# EAGLE design v1 (EAGLE 9.6.2)
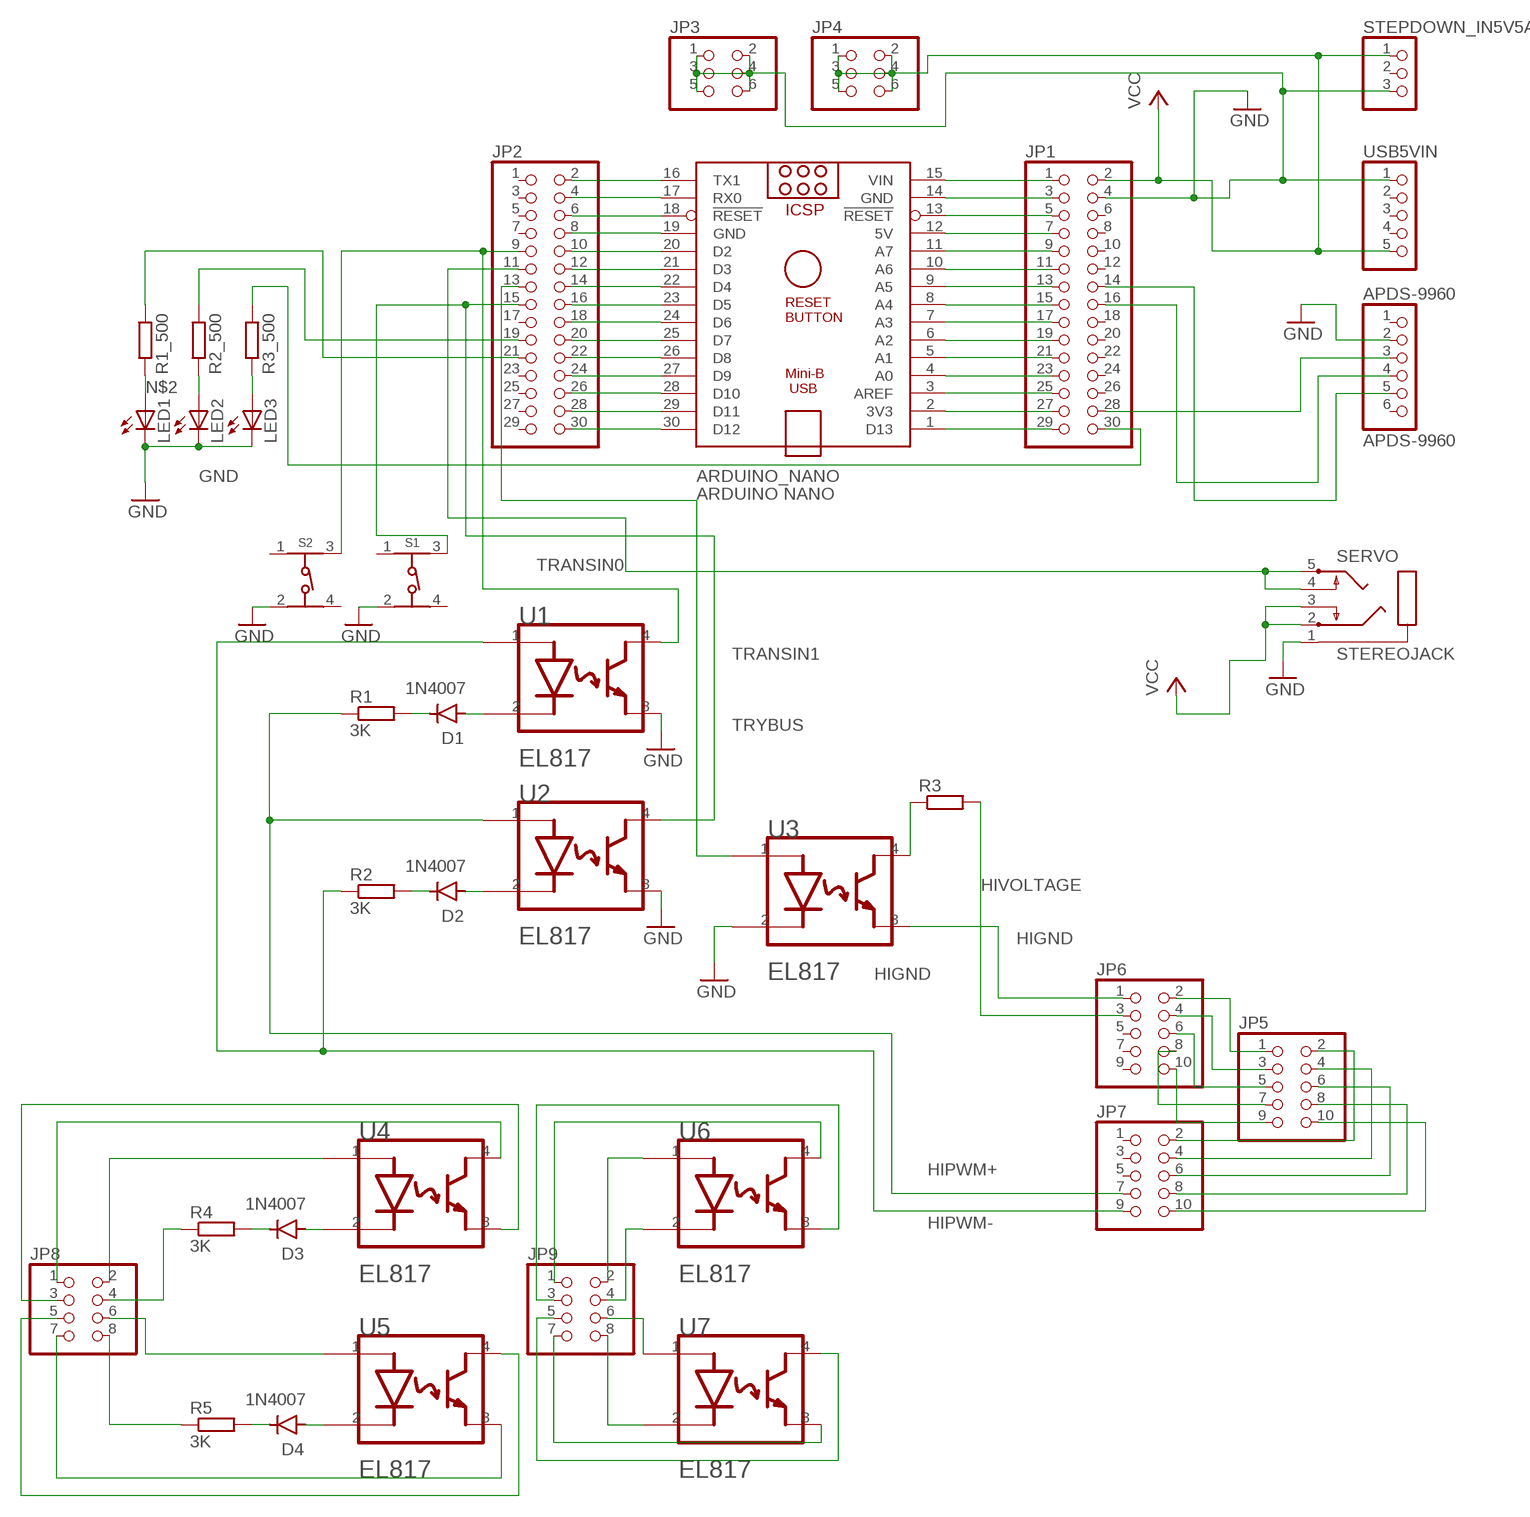
[diagram p0: schematic, sheet 1]

## Parts
APDS-9960  APDS-9960  PINHD-1X6  [1X06]
ARDUINO_NANO  ARDUINO NANO  ARDUINO_NANO  [ARDUINO_NANO]
D1  1N4007  [DO-41]
D2  1N4007  [DO-41]
D3  1N4007  [DO-41]
D4  1N4007  [DO-41]
JP1  PINHD-2X15  [2X15]
JP2  PINHD-2X15  [2X15]
JP3  PINHD-2X3  [2X03]
JP4  PINHD-2X3  [2X03]
JP5  PINHD-2X5  [2X05]
JP6  PINHD-2X5  [2X05]
JP7  PINHD-2X5  [2X05]
JP8  PINHD-2X4  [2X04]
JP9  PINHD-2X4  [2X04]
LED1  LED3MM  [LED3MM]
LED2  LED3MM  [LED3MM]
LED3  LED3MM  [LED3MM]
R1  3K  R-EU_0207/10  [0207/10]
R1_500  R-EU_0207/10  [0207/10]
R2  3K  R-EU_0207/10  [0207/10]
R2_500  R-EU_0207/10  [0207/10]
R3  R-EU_0207/10  [0207/10]
R3_500  R-EU_0207/10  [0207/10]
R4  3K  R-EU_0207/10  [0207/10]
R5  3K  R-EU_0207/10  [0207/10]
S1  430156070726  [4301X60707X6]
S2  430156070726  [4301X60707X6]
SERVO  STEREOJACK  [STX3100]
STEPDOWN_IN5V5A  PINHD-1X3  [1X03]
U1  EVERLIGHT_EL817EVERLIGHT_EL817_0_0  [EVERLIGHT_EL817_0]
U2  EVERLIGHT_EL817EVERLIGHT_EL817_0_0  [EVERLIGHT_EL817_0]
U3  EVERLIGHT_EL817EVERLIGHT_EL817_0_0  [EVERLIGHT_EL817_0]
U4  EVERLIGHT_EL817EVERLIGHT_EL817_0_0  [EVERLIGHT_EL817_0]
U5  EVERLIGHT_EL817EVERLIGHT_EL817_0_0  [EVERLIGHT_EL817_0]
U6  EVERLIGHT_EL817EVERLIGHT_EL817_0_0  [EVERLIGHT_EL817_0]
U7  EVERLIGHT_EL817EVERLIGHT_EL817_0_0  [EVERLIGHT_EL817_0]
USB5VIN  PINHD-1X5  [1X05]

## Nets
3V3: APDS-9960.3 JP1.28
D13: JP1.30 R3_500.1
GND [GND]: APDS-9960.2 JP1.4 JP3.1 JP3.2 JP3.3 JP3.4 JP3.5 JP3.6 LED1.K(C) LED2.K(C) LED3.K(C) S1.2 S2.2 SERVO.1 STEPDOWN_IN5V5A.3 U1.3(EMITTER) U2.3(EMITTER) U3.2(CATHODE) USB5VIN.1
HIGND [GND]: JP6.1 U3.3(EMITTER)
HIPWM+ [+5V]: JP7.7 R1.1 U2.1(ANODE)
HIPWM- [+5V]: JP7.9 R2.1 U1.1(ANODE)
HIPWM-1 [+5V]: JP8.4 R4.1
HIPWM-2 [+5V]: JP8.8 R5.1
HIVOLTAGE [+5V]: JP6.3 R3.2
LEDCLOSE: JP2.19 R2_500.1
LEDSENSOR: JP2.21 R1_500.1
N$1 [+5V]: LED1.A R1_500.2
N$2 [+5V]: LED2.A R2_500.2
N$3: LED3.A R3_500.2
N$4: D3.A U4.2(CATHODE)
N$5: D1.A U1.2(CATHODE)
N$6: D2.A U2.2(CATHODE)
N$7: D1.C R1.2
N$8: D2.C R2.2
N$9: D3.C R4.2
N$10: D4.A U5.2(CATHODE)
N$11: D4.C R5.2
N$12: ARDUINO_NANO.8(A4) JP1.15
N$15 [+5V]: JP5.1 JP6.2
N$16: ARDUINO_NANO.13(!RESET) JP1.5
N$17: ARDUINO_NANO.12(5V) JP1.7
N$18: ARDUINO_NANO.11(A7) JP1.9
N$20: ARDUINO_NANO.10(A6) JP1.11
N$21: ARDUINO_NANO.2(3V3) JP1.27
N$22: ARDUINO_NANO.9(A5) JP1.13
N$23: ARDUINO_NANO.7(A3) JP1.17
N$24: ARDUINO_NANO.6(A2) JP1.19
N$25: ARDUINO_NANO.5(A1) JP1.21
N$26: ARDUINO_NANO.4(A0) JP1.23
N$27: ARDUINO_NANO.3(AREF) JP1.25
N$28: ARDUINO_NANO.15(VIN) JP1.1
N$29: ARDUINO_NANO.1(D13) JP1.29
N$30: ARDUINO_NANO.16(TX1) JP2.2
N$31: ARDUINO_NANO.17(RX0) JP2.4
N$32: ARDUINO_NANO.18(!RESET) JP2.6
N$33: ARDUINO_NANO.19(GND) JP2.8
N$34: ARDUINO_NANO.20(D2) JP2.10
N$35 [GND]: ARDUINO_NANO.14(GND) JP1.3
N$36: ARDUINO_NANO.22(D4) JP2.14
N$37: ARDUINO_NANO.23(D5) JP2.16
N$38: ARDUINO_NANO.24(D6) JP2.18
N$39: ARDUINO_NANO.25(D7) JP2.20
N$40: ARDUINO_NANO.26(D8) JP2.22
N$41: ARDUINO_NANO.27(D9) JP2.24
N$42: ARDUINO_NANO.28(D10) JP2.26
N$43: ARDUINO_NANO.29(D11) JP2.28
N$44: ARDUINO_NANO.30(D12) JP2.30
N$45 [+5V]: JP5.3 JP6.4
N$46: JP5.5 JP6.6
N$47: ARDUINO_NANO.21(D3) JP2.12
N$48: JP5.7 JP6.8
N$49: JP5.9 JP6.10
N$50: JP5.2 JP7.2
N$51: JP5.4 JP7.4
N$52: JP5.6 JP7.6
N$53: JP5.8 JP7.8
N$54: JP5.10 JP7.10
N$55: JP8.2 U4.1(ANODE)
N$56: JP8.6 U5.1(ANODE)
N$57: JP8.1 U4.4(COLLECTOR)
N$58: R3.1 U3.4(COLLECTOR)
N$59: JP8.3 U4.3(EMITTER)
N$60: JP8.7 U5.3(EMITTER)
N$61: JP8.5 U5.4(COLLECTOR)
N$62: JP9.2 U6.1(ANODE)
N$63: JP9.4 U6.2(CATHODE)
N$64: JP9.6 U7.1(ANODE)
N$65: JP9.8 U7.2(CATHODE)
N$66: JP9.1 U6.4(COLLECTOR)
N$67: JP9.3 U6.3(EMITTER)
N$68: JP9.7 U7.3(EMITTER)
N$69: JP9.5 U7.4(COLLECTOR)
SCL: APDS-9960.5 JP1.14
SDA: APDS-9960.4 JP1.16
SERVO: JP2.11 SERVO.4 SERVO.5
TRANSIN0: JP2.9 S2.3 U1.4(COLLECTOR)
TRANSIN1: JP2.15 S1.3 U2.4(COLLECTOR)
TRYBUS: JP2.13 U3.1(ANODE)
VCC: JP1.2 JP4.1 JP4.2 JP4.3 JP4.4 JP4.5 JP4.6 SERVO.2 SERVO.3 STEPDOWN_IN5V5A.1 USB5VIN.5
Unconnected: APDS-9960.1 APDS-9960.6 JP1.6 JP1.8 JP1.10 JP1.12 JP1.18 JP1.20 JP1.22 JP1.24 JP1.26 JP2.1 JP2.3 JP2.5 JP2.7 JP2.17 JP2.23 JP2.25 JP2.27 JP2.29 JP6.5 JP6.7 JP6.9 JP7.1 JP7.3 JP7.5 S1.1 S1.4 S2.1 S2.4 STEPDOWN_IN5V5A.2 USB5VIN.2 USB5VIN.3 USB5VIN.4

## Library data of the parts
APDS-9960 = pinhead:PINHD-1X6: PIN HEADER
ARDUINO_NANO = ArduinoNanoV30:ARDUINO_NANO: Arduino Nano V3.0 Overview: The Arduino Nano is a small, complete, and breadboard-friendly board based on the ATmega328 (Arduino Nano 3.x) or ATmega168 (Arduino Nano 2.x). It has more or less the same functionality of the Arduino Duemilanove, but in a different package. It lacks only a DC power jack, and works with a Mini-B USB cable instead of a standard one. The Nano was designed and is being produced by Gravitech. Specifications: Microcontroller Atmel ATmega168 or ATmega328 Operating Voltage (logic level) 5 V Input Voltage (recommended) 7-12 V Input Voltage (limits) 6-20 V Digital I/O Pins 14 (of which 6 provide PWM output) Analog Input Pins 8 DC Current per I/O Pin 40 mA Flash Memory 16 KB (ATmega168) or 32 KB (ATmega328) of which 2 KB used by bootloader SRAM 1 KB (ATmega168) or 2 KB (ATmega328) EEPROM 512 bytes (ATmega168) or 1 KB (ATmega328) Clock Speed 16 MHz Dimensions 0.73" x 1.70" Length 45 mm Width 18 mm Weigth 5 g Power: The Arduino Nano can be powered via the Mini-B USB connection, 6-20V unregulated external power supply (pin 30), or 5V regulated external power supply (pin 27). The power source is automatically selected to the highest voltage source. Memory: The ATmega168 has 16 KB of flash memory for storing code (of which 2 KB is used for the bootloader); the ATmega328 has 32 KB, (also with 2 KB used for the bootloader). The ATmega168 has 1 KB of SRAM and 512 bytes of EEPROM (which can be read and written with the EEPROM library); the ATmega328 has 2 KB of SRAM and 1 KB of EEPROM. Input and Output: Each of the 14 digital pins on the Nano can be used as an input or output, using pinMode(), digitalWrite(), and digitalRead() functions. They operate at 5 volts. Each pin can provide or receive a maximum of 40 mA and has an internal pull-up resistor (disconnected by default) of 20-50 kOhms. In addition, some pins have specialized functions. Visit Arduino - ArduinoBoardNano <https://www.arduino.cc/en/Main/ArduinoBoardNano>
D1-D4 = Diodes:1N4007: DIODE GEN PURP 1KV 1A DO41 Manufacturer's datasheet <https://www.mccsemi.com/pdf/Products/1N4001-1N4007(DO-41).pdf>; CREATED_BY: PCBLayout.com; DIGIKEY_PART_NUMBER: 1N4007MSCT-ND; MANUFACTURER: Micro Commercial Co; MPN: 1N4007; PACKAGE: DO-41
JP1 JP2 = pinhead:PINHD-2X15: PIN HEADER
JP3 JP4 = pinhead:PINHD-2X3: PIN HEADER
JP5-JP7 = pinhead:PINHD-2X5: PIN HEADER
JP8 JP9 = pinhead:PINHD-2X4: PIN HEADER
LED1-LED3 = adafruit:LED: LED OSRAM: - CHIPLED LG R971, LG N971, LY N971, LG Q971, LY Q971, LO R971, LY R971 LH N974, LH R974 LS Q976, LO Q976, LY Q976 LO Q996 - Hyper CHIPLED LW Q18S LB Q993, LB Q99A, LB R99A - SideLED LS A670, LO A670, LY A670, LG A670, LP A670 LB A673, LV A673, LT A673, LW A673 LH A674 LY A675 LS A676, LA A676, LO A676, LY A676, LW A676 LS A679, LY A679, LG A679 - Hyper Micro SIDELED® LS Y876, LA Y876, LO Y876, LY Y876 LT Y87S - SmartLED LW L88C, LW L88S LB L89C, LB L89S, LG L890 LS L89K, LO L89K, LY L89K LS L896, LA L896, LO L896, LY L896 - TOPLED LS T670, LO T670, LY T670, LG T670, LP T670 LSG T670, LSP T670, LSY T670, LOP T670, LYG T670 LG T671, LOG T671, LSG T671 LB T673, LV T673, LT T673, LW T673 LH T674 LS T676, LA T676, LO T676, LY T676, LB T676, LH T676, LSB T676, LW T676 LB T67C, LV T67C, LT T67C, LS T67K, LO T67K, LY T67K, LW E67C LS E67B, LA E67B, LO E67B, LY E67B, LB E67C, LV E67C, LT E67C LW T67C LS T679, LY T679, LG T679 LS T770, LO T770, LY T770, LG T770, LP T770 LB T773, LV T773, LT T773, LW T773 LH T774 LS E675, LA E675, LY E675, LS T675 LS T776, LA T776, LO T776, LY T776, LB T776 LHGB T686 LT T68C, LB T68C - Hyper Mini TOPLED® LB M676 - Mini TOPLED Santana® LG M470 LS M47K, LO M47K, LY M47K Source: http://www.osram.convergy.de/
R1 R1_500 R2 R2_500 R3 R3_500 R4 R5 = rcl:R-EU_: RESISTOR, European symbol; SPICEPREFIX: R
S1 S2 = Wurth_Switch_WS-TATV:430156070726: WS-TATV THT Tact Switch 6x6 mm Material Properties Cover Material : Stainless Steel Properties Actuator Material:LCP Actuator Flammability Rating:UL94 V-0 Actuator Color:Black; Salmon; White Frame Material:PPA Frame Flammability Rating:UL94 HB Frame Color:Black Contact Material:Stainless Steel Contact Plating:Silver Terminal Material:Copper Alloy Terminal Plating:Silver VR:12 V (DC) Contact Resistance Initial:100 mΩ Contact Resistance After Life Test:2 Ω RISO:100 MΩ Withstanding Voltage:250 V (AC) Washable:No Qty.:200 Mechanical Properties Stroke 0.25 mm General Information Operating Temperature:-40 up to +85 °C Washable:No Packaging Properties Packaging:Bulk <https://www.we-online.com/catalog/media/o61106v209%20Family_WS_TST_THT_4301x6xxx7x6_pf2.jpg> Details see: https://www.we-online.com/catalog/en/TATV_6X6_THT_4301x6xxx7x6/ Updated by yingchun,Shan;2020-02-21 2020(C) Würth Elektronik; DATASHEET-URL: https://www.we-online.com/catalog/datasheet/430156070726.pdf; H: 7.0mm; OPERATION-FORCE: 260g; PART-NUMBER: 430156070726; QTY: 200
SERVO = adafruit:STEREOJACK: MIC/HEADPHONE JACK Stereo jack with two switches. Kycon STX3100, CUI SJ1-3555NG and/or 4UCon 05544
STEPDOWN_IN5V5A = pinhead:PINHD-1X3: PIN HEADER
U1-U7 = Everlight - EL817:EVERLIGHT_EL817: 4-Pin Optocoupler - Phototransistor; CENTROID_NOT_SPECIFIED: No; DATASHEET: http://www.everlight.com/file/ProductFile/201407061833256242.pdf; DIGIKEY_DESCRIPTION: IC Optoisolator Transistor Output 5000Vrms 1 Channel 4-DIP; DIGIKEY_PART_NUMBER: EL817-ND; LEAD_FREE: yes; MF: Everlight; MOUSER_PART_NUMBER: 638-817; MPN: EL817; PACKAGE: DIP4; PREFIX: U; ROHS: yes; TEMPERATURE_RANGE_HIGH: +110°C; TEMPERATURE_RANGE_LOW: -55°C
USB5VIN = pinhead:PINHD-1X5: PIN HEADER

## Net classes
0 default: width 0.356 mm, drill 1.016 mm, clearance 0.305 mm
1 GND: width 0.914 mm, drill 1.016 mm, clearance 0.406 mm
2 +5V: width 0.66 mm, drill 1.016 mm, clearance 0.406 mm
3 BUS: width 0.203 mm, drill 1.016 mm, clearance 0.254 mm

## Board
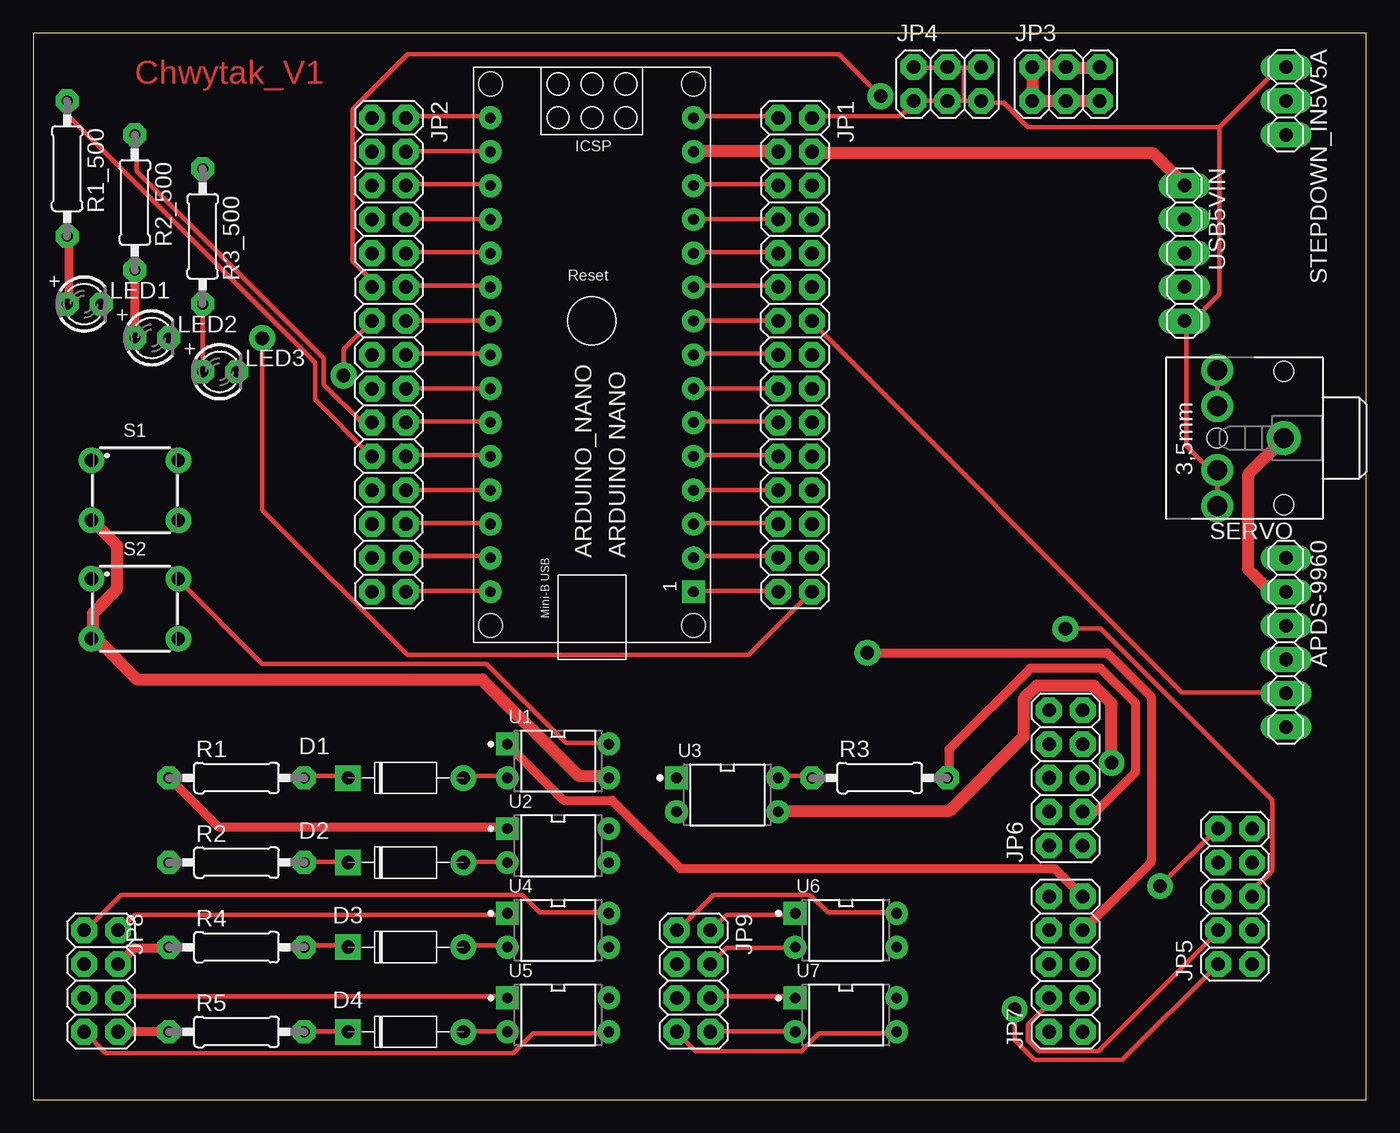
[diagram p1: board, top side]
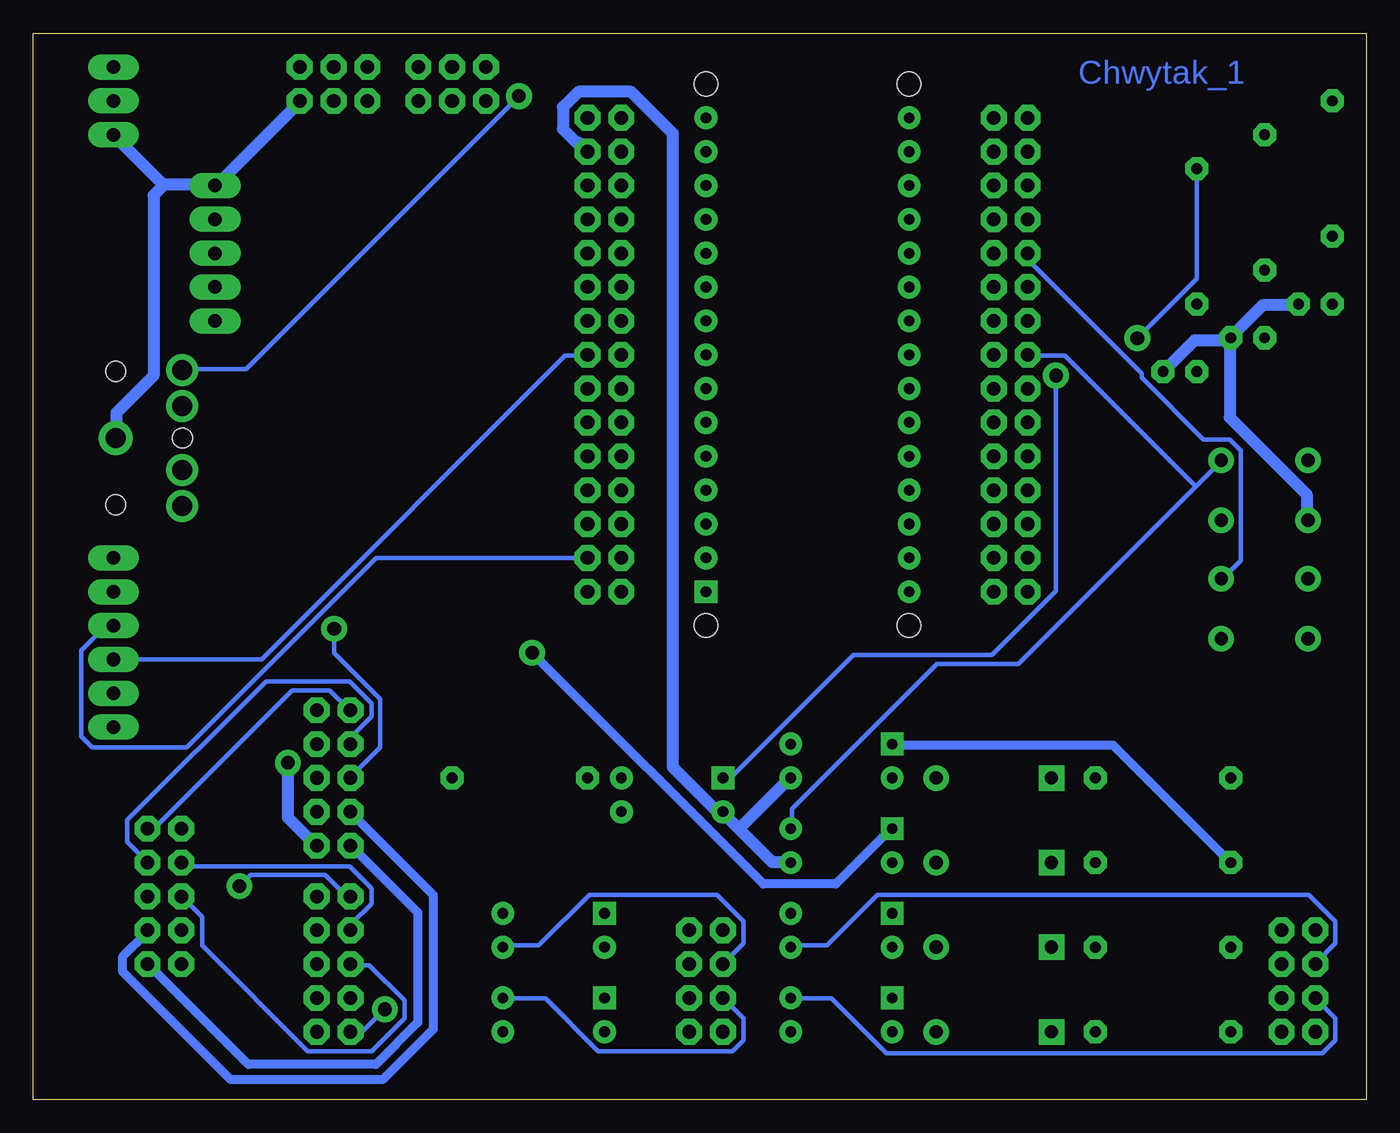
[diagram p2: board, bottom side, seen from below]

Size 100 x 80 mm. Coordinates in mm from the lower left corner, seen from the top.
Outline: 0,0 100,0 100,80 0,80 0,0
Copper layers (1*16): Top 0.035mm / dielectric 1.5mm / Bottom 0.035mm
Design rules "default *": minimum track width 10mil, minimum drill 0.35mm, track to track 10mil, track to pad 10mil, pad to pad 10mil, via to via 10mil, smd to smd 10mil, copper to edge 40mil, drill to drill 10mil, minimum pad ring 18mil, minimum via ring 18mil, stop-mask expansion 4mil, vias tented up to drill 0mil, thermal gap 10mil

### Footprints (pad centres in the part's own frame; a part is rotated, then mirrored left to right if it is on the bottom)
1X06 = drill 1.016 long: 1 -6.35,0; 2 -3.81,0; 3 -1.27,0; 4 1.27,0; 5 3.81,0; 6 6.35,0
ARDUINO_NANO = drill 0.8 square: 1 -20.32,-7.62 | drill 0.8: 2 -17.78,-7.62; 3 -15.24,-7.62; 4 -12.7,-7.62; 5 -10.16,-7.62; 6 -7.62,-7.62; 7 -5.08,-7.62; 8 -2.54,-7.62; 9 0,-7.62; 10 2.54,-7.62; 11 5.08,-7.62; 12 7.62,-7.62; 13 10.16,-7.62; 14 12.7,-7.62; 15 15.24,-7.62; 16 15.24,7.62; 17 12.7,7.62; 18 10.16,7.62; 19 7.62,7.62; 20 5.08,7.62; 21 2.54,7.62; 22 0,7.62; 23 -2.54,7.62; 24 -5.08,7.62; 25 -7.62,7.62; 26 -10.16,7.62; 27 -12.7,7.62; 28 -15.24,7.62; 29 -17.78,7.62; 30 -20.32,7.62 | hole 1.778: -22.86,-7.62; -22.86,7.62; 17.78,7.62; 17.78,-7.62
DO-41 = drill 1: A 4.325,0 | drill 1 square: C -4.325,0
2X15 = drill 1.016 octagon: 1 -17.78,-1.27; 2 -17.78,1.27; 3 -15.24,-1.27; 4 -15.24,1.27; 5 -12.7,-1.27; 6 -12.7,1.27; 7 -10.16,-1.27; 8 -10.16,1.27; 9 -7.62,-1.27; 10 -7.62,1.27; 11 -5.08,-1.27; 12 -5.08,1.27; 13 -2.54,-1.27; 14 -2.54,1.27; 15 0,-1.27; 16 0,1.27; 17 2.54,-1.27; 18 2.54,1.27; 19 5.08,-1.27; 20 5.08,1.27; 21 7.62,-1.27; 22 7.62,1.27; 23 10.16,-1.27; 24 10.16,1.27; 25 12.7,-1.27; 26 12.7,1.27; 27 15.24,-1.27; 28 15.24,1.27; 29 17.78,-1.27; 30 17.78,1.27
2X03 = drill 1.016 octagon: 1 -2.54,-1.27; 2 -2.54,1.27; 3 0,-1.27; 4 0,1.27; 5 2.54,-1.27; 6 2.54,1.27
2X05 = drill 1.016 octagon: 1 -5.08,-1.27; 2 -5.08,1.27; 3 -2.54,-1.27; 4 -2.54,1.27; 5 0,-1.27; 6 0,1.27; 7 2.54,-1.27; 8 2.54,1.27; 9 5.08,-1.27; 10 5.08,1.27
2X04 = drill 1.016 octagon: 1 -3.81,-1.27; 2 -3.81,1.27; 3 -1.27,-1.27; 4 -1.27,1.27; 5 1.27,-1.27; 6 1.27,1.27; 7 3.81,-1.27; 8 3.81,1.27
LED3MM = drill 0.813 pad 1.676 octagon: A -1.27,0; K 1.27,0
0207/10 = drill 0.813 octagon: 1 -5.08,0; 2 5.08,0
4301X60707X6 = drill 1: 1 -3.25,2.25; 2 -3.25,-2.25; 3 3.25,2.25; 4 3.25,-2.25
STX3100 = drill 1.5 pad 2.54: 1 2.7,-0.1 | drill 1.5: 2 7.7,5; 3 7.7,2.3; 4 7.7,-2.5; 5 7.7,-5.2 | hole 1.5: 2.7,4.9; 2.7,-5.1; 7.7,-0.1
1X03 = drill 1.016 long: 1 -2.54,0; 2 0,0; 3 2.54,0
EVERLIGHT_EL817_0 = drill 0.8 pad 1.3 square: 1 -3.81,1.27 | drill 0.8 pad 1.3: 2 -3.81,-1.27; 3 3.81,-1.27; 4 3.81,1.27
1X05 = drill 1.016 long: 1 -5.08,0; 2 -2.54,0; 3 0,0; 4 2.54,0; 5 5.08,0

### Placement (x,y rotation side)
APDS-9960  93.98,34.29 270 top
ARDUINO_NANO  41.91,58.42 90 top
D1  27.94,24.13 0 top
D2  27.94,17.78 0 top
D3  27.94,11.43 0 top
D4  27.94,5.08 0 top
JP1  57.15,55.88 270 top
JP2  26.67,55.88 270 top
JP3  77.47,76.2 0 top
JP4  68.58,76.2 0 top
JP5  90.17,15.24 90 top
JP6  77.47,24.13 90 top
JP7  77.47,10.16 90 top
JP8  5.08,8.89 270 top
JP9  49.53,8.89 270 top
LED1  3.81,59.69 0 top
LED2  8.89,57.15 0 top
LED3  13.97,54.61 0 top
R1  15.24,24.13 0 top
R1_500  2.54,69.85 270 top
R2  15.24,17.78 0 top
R2_500  7.62,67.31 270 top
R3  63.5,24.13 0 top
R3_500  12.7,64.77 270 top
R4  15.24,11.43 0 top
R5  15.24,5.08 0 top
S1  7.62,45.72 0 top
S2  7.62,36.83 0 top
SERVO  96.52,49.53 180 top
STEPDOWN_IN5V5A  93.98,74.93 270 top
U1  39.37,25.4 0 top
U2  39.37,19.05 0 top
U3  52.07,22.86 0 top
U4  39.37,12.7 0 top
U5  39.37,6.35 0 top
U6  60.96,12.7 0 top
U7  60.96,6.35 0 top
USB5VIN  86.36,63.5 270 top

### Tracks (layer width: path | path; a pad name or v marks a point on that pad's centre or on a via)
3V3
  Bottom 0.356: APDS-9960.3 94.11,35.5 94.6,35.5 96.42,33.68 96.42,27.24 95.59,26.42 88.49,26.42 74.3,40.62 58.45,40.62 JP1.28
D13  (via drill 1.02)
  Top 0.356: v17.17,57.12 17.17,44.25 28.07,33.35 53.66,33.35 58.28,37.97 JP1.30
  Bottom 0.356: v17.17,57.12 12.71,61.58 12.71,69.84 R3_500.1
GND
  Top 0.914: APDS-9960.2 93.94,38.14 92.79,38.14 91.14,39.79 91.14,46.89 93.78,49.53 SERVO.1 | JP3.5 79.91,74.95 77.93,74.95 JP3.3 77.43,74.95 75.29,74.95 JP3.1 74.95,74.95 74.95,77.43 JP3.2 75.29,77.6 77.43,77.6 JP3.4 77.93,77.43 79.91,77.43 JP3.6 | JP1.4 58.45,70.99 84.04,70.99 86.35,68.68 USB5VIN.1 | S1.2 4.46,43.42 6.27,41.6 6.27,38.3 4.46,36.49 4.46,34.67 S2.2 4.79,34.51 7.76,31.53 33.68,31.53 40.95,24.27 43.09,24.27 U1.3
  Bottom 0.914: 90.31,68.68 86.51,68.68 USB5VIN.1 86.02,68.85 80.07,74.79 JP3.5 | 90.31,68.68 93.94,72.31 STEPDOWN_IN5V5A.3 | SERVO.1 93.78,49.7 93.78,51.51 90.97,54.32 90.97,67.86 90.47,68.35 90.31,68.68 | 47.05,20.31 48.21,21.46 U3.2 48.7,21.63 52.01,24.93 52.01,72.48 55.14,75.62 59.11,75.62 60.26,74.46 60.26,72.81 59.27,71.82 59.11,71.82 58.45,71.16 JP1.4 | 47.05,20.31 44.58,17.83 43.26,17.83 U2.3 | 47.05,20.31 43.26,24.11 U1.3 | LED2.K 10.07,57.29 7.76,59.6 5.12,59.6 LED1.K | LED3.K 15.19,54.65 12.88,56.96 10.57,56.96 LED2.K | S1.2 4.46,43.59 4.46,45.4 10.24,51.18 10.24,56.63 LED2.K
HIGND  (via drill 1.02)
  Top 0.914: v80.9,25.26 80.9,29.72 79.58,31.04 75.29,31.04 74.3,30.05 74.3,27.24 68.68,21.63 55.97,21.63 U3.3
  Bottom 0.914: v80.9,25.26 80.9,21.13 78.75,18.99 JP6.1
HIPWM+  (via drill 1.02)
  Top 0.66: U2.1 35.5,20.47 13.87,20.47 10.24,24.11 R1.1 | JP7.7 83.87,17.83 83.87,30.21 80.57,33.52 v62.57,33.52
  Bottom 0.66: v62.57,33.52 45.24,16.18 39.79,16.18 35.66,20.31 U2.1
HIPWM-
  Top 0.66: JP7.9 78.59,15.35 76.61,17.34 48.54,17.34 43.42,22.45 39.79,22.45 35.66,26.58 U1.1
  Bottom 0.66: U1.1 35.5,26.58 18.99,26.58 10.24,17.83 R2.1
HIPWM-1
  Top 0.66: R4.1 10.07,11.39 7.59,11.39 6.44,10.24 JP8.4
HIPWM-2
  Top 0.66: R5.1 10.07,5.12 6.44,5.12 JP8.8
HIVOLTAGE
  Top 0.66: R3.2 68.68,24.27 68.68,26.25 74.79,32.36 80.07,32.36 82.72,29.72 82.72,24.6 79.74,21.63 78.75,21.63 JP6.3
LEDCLOSE
  Top 0.356: R2_500.1 7.76,72.31 7.76,69.67 21.79,55.64 21.79,53.66 24.6,50.85 25.26,50.85 JP2.19
LEDSENSOR
  Top 0.356: R1_500.1 2.64,74.79 2.64,73.8 21.13,55.31 21.13,52.5 25.26,48.37 JP2.21
N$1
  Top 0.66: LED1.A 2.64,59.77 2.64,64.72 R1_500.2
N$2
  Top 0.66: LED2.A 7.59,57.29 7.59,62.08 R2_500.2
N$3
  Top 0.356: LED3.A 12.71,54.65 12.71,59.6 R3_500.2
N$4
  Top 0.356: U4.2 35.5,11.56 32.36,11.56 D3.A
N$5
  Top 0.356: U1.2 35.5,24.27 32.36,24.27 D1.A
N$6
  Top 0.356: U2.2 35.5,17.83 32.36,17.83 D2.A
N$7
  Top 0.356: R1.2 20.47,24.27 23.61,24.27 D1.C
N$8
  Top 0.356: R2.2 20.47,17.83 23.61,17.83 D2.C
N$9
  Top 0.356: R4.2 20.47,11.56 23.61,11.56 D3.C
N$10
  Top 0.356: U5.2 35.5,5.12 32.36,5.12 D4.A
N$11
  Top 0.356: R5.2 20.47,5.12 23.61,5.12 D4.C
N$12
  Top 0.356: ARDUINO_NANO.8 49.53,55.97 55.8,55.97 JP1.15
N$15
  Bottom 0.66: JP5.1 91.3,10.07 83.87,2.64 74.3,2.64 71.16,5.78 71.16,14.03 76.11,18.99 JP6.2
N$16
  Top 0.356: ARDUINO_NANO.13 49.53,68.68 55.8,68.68 JP1.5
N$17
  Top 0.356: JP1.7 ARDUINO_NANO.12
N$18
  Top 0.356: ARDUINO_NANO.11 49.53,63.56 55.8,63.56 JP1.9
N$20
  Top 0.356: ARDUINO_NANO.10 49.53,61.09 55.8,61.09 JP1.11
N$21
  Top 0.356: ARDUINO_NANO.2 49.53,40.78 55.8,40.78 JP1.27
N$22
  Top 0.356: ARDUINO_NANO.9 49.53,58.45 55.8,58.45 JP1.13
N$23
  Top 0.356: ARDUINO_NANO.7 49.53,53.33 55.8,53.33 JP1.17
N$24
  Top 0.356: ARDUINO_NANO.6 49.53,50.85 55.8,50.85 JP1.19
N$25
  Top 0.356: ARDUINO_NANO.5 49.53,48.37 55.8,48.37 JP1.21
N$26
  Top 0.356: ARDUINO_NANO.4 49.53,45.73 55.8,45.73 JP1.23
N$27
  Top 0.356: ARDUINO_NANO.3 49.53,43.26 55.8,43.26 JP1.25
N$28
  Top 0.356: ARDUINO_NANO.15 49.53,73.8 55.8,73.8 JP1.1
N$29
  Top 0.356: ARDUINO_NANO.1 49.53,38.14 55.8,38.14 JP1.29
N$30
  Top 0.356: ARDUINO_NANO.16 34.18,73.8 28.07,73.8 JP2.2
N$31
  Top 0.356: ARDUINO_NANO.17 34.18,71.16 28.07,71.16 JP2.4
N$32
  Top 0.356: ARDUINO_NANO.18 34.18,68.68 28.07,68.68 JP2.6
N$33
  Top 0.356: JP2.8 ARDUINO_NANO.19
N$34
  Top 0.356: ARDUINO_NANO.20 34.18,63.56 28.07,63.56 JP2.10
N$35
  Top 0.914: ARDUINO_NANO.14 49.53,71.16 55.8,71.16 JP1.3
N$36
  Top 0.356: ARDUINO_NANO.22 34.18,58.45 28.07,58.45 JP2.14
N$37
  Top 0.356: ARDUINO_NANO.23 34.18,55.97 28.07,55.97 JP2.16
N$38
  Top 0.356: ARDUINO_NANO.24 34.18,53.33 28.07,53.33 JP2.18
N$39
  Top 0.356: ARDUINO_NANO.25 34.18,50.85 28.07,50.85 JP2.20
N$40
  Top 0.356: ARDUINO_NANO.26 34.18,48.37 28.07,48.37 JP2.22
N$41
  Top 0.356: ARDUINO_NANO.27 34.18,45.73 28.07,45.73 JP2.24
N$42
  Top 0.356: ARDUINO_NANO.28 34.18,43.26 28.07,43.26 JP2.26
N$43
  Top 0.356: ARDUINO_NANO.29 34.18,40.78 28.07,40.78 JP2.28
N$44
  Top 0.356: ARDUINO_NANO.30 34.18,38.14 28.07,38.14 JP2.30
N$45
  Bottom 0.66: JP5.3 91.47,12.55 93.28,10.73 93.28,9.58 85.19,1.49 73.8,1.49 70,5.28 70,15.35 76.11,21.46 JP6.4
N$46  (via drill 1.02)
  Top 0.356: v77.43,35.33 80.07,35.33 92.95,22.45 92.95,17.17 91.47,15.68 91.47,15.35 JP5.5
  Bottom 0.356: v77.43,35.33 77.43,33.52 73.97,30.05 73.97,26.42 76.11,24.27 JP6.6
N$47
  Top 0.356: ARDUINO_NANO.21 34.18,61.09 28.07,61.09 JP2.12
N$48
  Bottom 0.356: JP6.8 76.11,26.75 76.11,27.24 74.62,28.73 74.62,29.72 76.28,31.37 82.55,31.37 92.95,20.97 92.95,19.32 91.47,17.83 JP5.7
N$49
  Bottom 0.356: JP5.9 91.3,20.47 90.81,20.47 80.57,30.71 77.76,30.71 76.28,29.22 JP6.10
N$50  (via drill 1.02)
  Top 0.356: v73.64,6.77 73.64,4.46 75.12,2.97 81.72,2.97 88.82,10.07 JP5.2
  Bottom 0.356: v73.64,6.77 75.29,5.12 76.11,5.12 JP7.2
N$51
  Top 0.356: JP7.4 76.11,7.59 76.11,7.1 74.62,5.61 74.62,4.46 75.45,3.63 79.91,3.63 88.82,12.55 JP5.4
N$52
  Bottom 0.356: JP7.6 76.11,10.07 74.79,10.07 72.15,7.43 72.15,6.11 74.62,3.63 79.41,3.63 87.34,11.56 87.34,13.7 88.82,15.19 JP5.6
N$53
  Bottom 0.356: JP7.8 76.11,12.71 76.11,13.21 74.62,14.69 74.62,15.85 76.28,17.5 88.66,17.5 88.82,17.67 JP5.8
N$54  (via drill 1.02)
  Top 0.356: v84.53,16.02 88.82,20.31 JP5.10
  Bottom 0.356: v84.53,16.02 83.71,16.84 78.09,16.84 76.61,15.35 76.28,15.35 JP7.10
N$55
  Top 0.356: U4.1 35.5,13.87 7.59,13.87 6.44,12.71 JP8.2
N$56
  Top 0.356: U5.1 35.5,7.76 6.44,7.76 JP8.6
N$57
  Top 0.356: U4.4 43.09,14.03 37.97,14.03 36.65,15.35 6.6,15.35 3.96,12.71 JP8.1
N$58
  Top 0.356: U3.4 55.97,24.27 58.28,24.27 R3.1
N$59
  Bottom 0.356: U4.3 43.09,11.56 40.45,11.56 36.65,15.35 4.29,15.35 2.31,13.37 2.31,11.72 3.8,10.24 JP8.3
N$60
  Top 0.356: U5.3 43.09,4.95 37.48,4.95 35.99,3.47 5.45,3.47 3.96,4.95 JP8.7
N$61
  Bottom 0.356: U5.4 43.09,7.59 40.12,7.59 35.99,3.47 3.3,3.47 2.31,4.46 2.31,6.11 3.8,7.59 JP8.5
N$62
  Top 0.356: U6.1 57.12,13.87 52.01,13.87 50.85,12.71 JP9.2
N$63
  Top 0.356: U6.2 57.12,11.39 52.01,11.39 50.85,10.24 JP9.4
N$64
  Top 0.356: U7.1 57.12,7.76 50.85,7.76 JP9.6
N$65
  Top 0.356: U7.2 57.12,5.12 50.85,5.12 JP9.8
N$66
  Top 0.356: U6.4 64.72,14.03 59.6,14.03 58.28,15.35 51.02,15.35 48.37,12.71 JP9.1
N$67
  Bottom 0.356: U6.3 64.72,11.56 62.08,11.56 58.28,15.35 48.7,15.35 46.72,13.37 46.72,11.72 48.21,10.24 JP9.3
N$68
  Top 0.356: U7.3 64.72,4.95 58.94,4.95 57.62,3.63 49.7,3.63 48.37,4.95 JP9.7
N$69
  Bottom 0.356: U7.4 64.72,7.59 61.58,7.59 57.62,3.63 47.55,3.63 46.72,4.46 46.72,6.11 48.21,7.59 JP9.5
SCL
  Top 0.356: APDS-9960.5 93.94,30.54 86.18,30.54 58.45,58.28 JP1.14
SDA
  Bottom 0.356: APDS-9960.4 82.88,33.02 60.1,55.8 58.45,55.8 JP1.16
SERVO  (via drill 1.02)
  Top 0.356: v63.56,75.29 60.43,78.42 28.07,78.42 23.94,74.3 23.94,62.9 25.26,61.58 25.26,61.09 JP2.11 | SERVO.4 88.82,52.17 88.82,54.65 SERVO.5
  Bottom 0.356: v63.56,75.29 84.04,54.81 88.66,54.81 SERVO.5
TRANSIN0
  Top 0.356: U1.4 43.09,26.75 39.95,26.75 34.01,32.69 17.17,32.69 10.9,38.96 S2.3
  Bottom 0.356: JP2.9 25.26,63.4 25.26,62.9 16.84,54.48 16.84,54.15 12.22,49.53 10.24,49.53 9.41,48.7 9.41,40.45 10.73,39.13 S2.3
TRANSIN1
  Bottom 0.356: 12.79,45.98 10.9,47.88 S1.3 | 12.79,45.98 26.09,32.69 32.19,32.69 43.09,21.79 43.09,20.47 U2.4 | 12.79,45.98 22.62,55.8 25.26,55.8 JP2.15
TRYBUS  (via drill 1.02)
  Top 0.356: v23.28,54.32 23.28,56.3 JP2.13
  Bottom 0.356: v23.28,54.32 23.28,38.14 28.07,33.35 38.47,33.35 47.55,24.27 48.21,24.27 U3.1
VCC
  Top 0.356: 69.84,74.95 70.99,74.95 JP4.5 71.16,74.79 72.81,74.79 74.62,72.97 88.99,72.97 | 69.84,74.95 68.68,74.95 JP4.3 68.52,74.95 66.2,74.95 JP4.1 66.04,74.79 65.05,73.8 58.45,73.8 JP1.2 | JP4.2 66.04,77.43 68.52,77.43 JP4.4 68.68,77.43 69.84,77.43 | 69.84,77.43 70.99,77.43 JP4.6 | 69.84,77.43 69.84,74.95 | 88.99,72.97 93.45,77.43 93.94,77.43 STEPDOWN_IN5V5A.1 | 88.99,72.97 88.99,60.43 86.68,58.12 USB5VIN.5 86.51,58.28 86.51,49.03 88.16,47.38 88.66,47.38 SERVO.3 88.82,47.05 88.82,44.58 SERVO.2

### Text on the board
Top: Chwytak_V1
Bottom: Chwytak_1